# Altium schematic sheet LCD + TOUCH .SchDoc: MISKO 3.0
size A4; Date: 19.9.2021; Author: AMADEJ PAPEŽ; SheetNumber: 7; SheetTotal: 13; SheetTitle: LCD + TOUCH; Version: V1.1
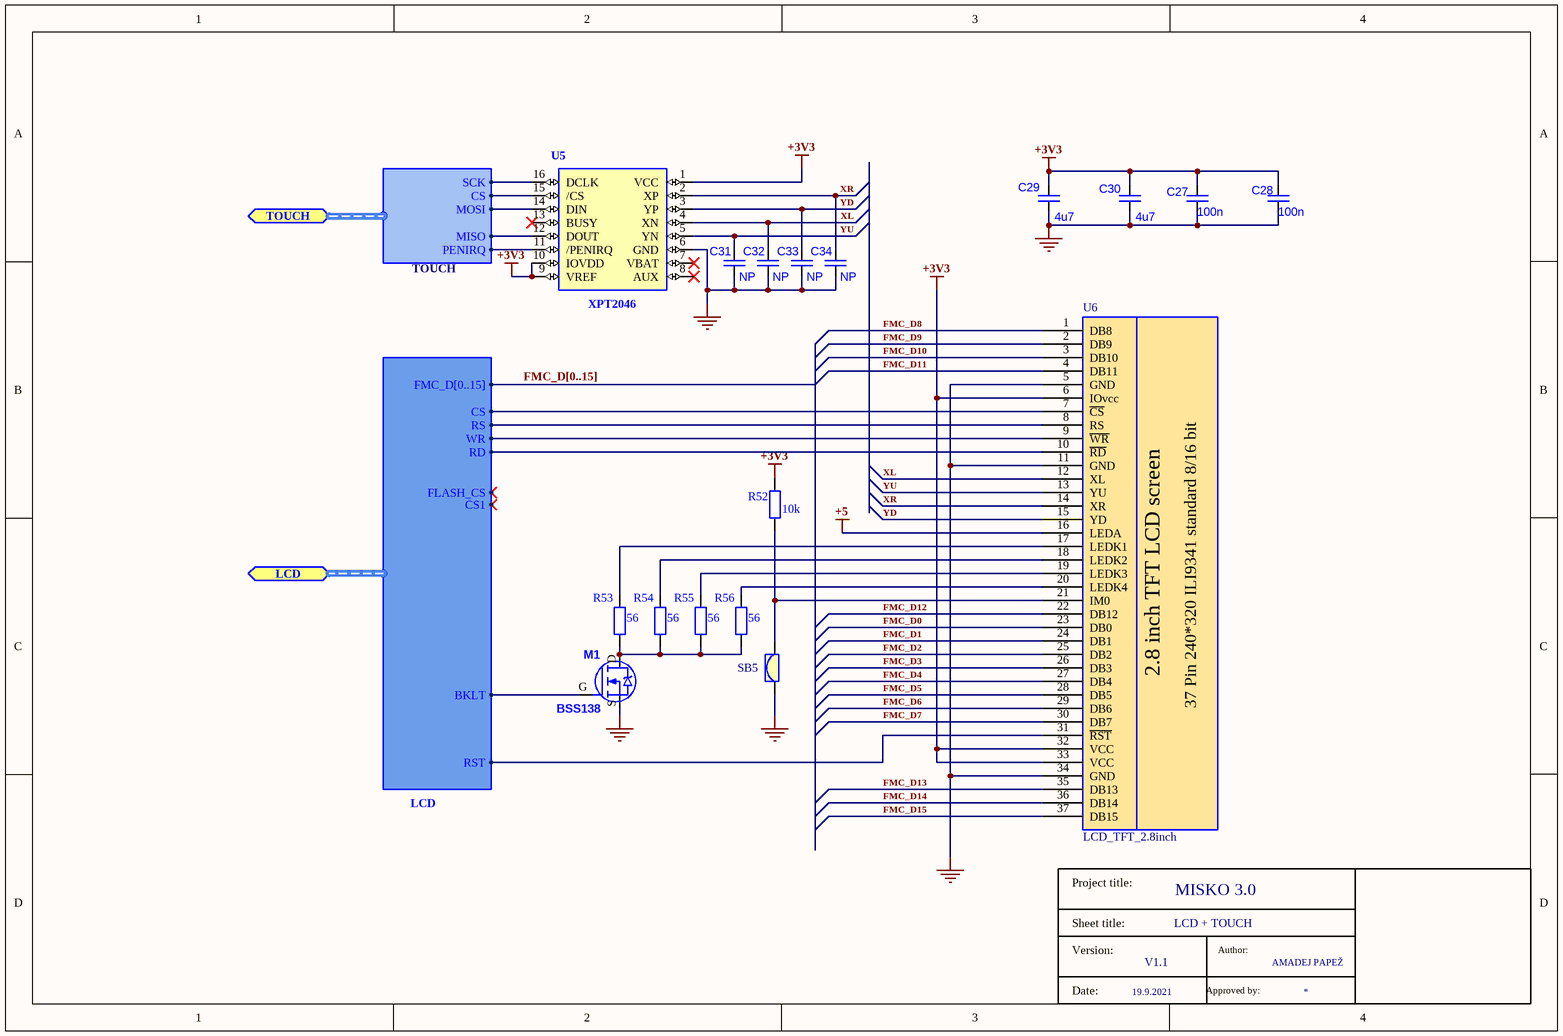
[diagram p0: LCD + TOUCH .SchDoc]

## Parts
C27  value 100n  [C0603]
C28  value 100n  [C0603]
C29  value 4u7  [C0603]
C30  value 4u7  [C0603]
C31  value NP  [C0603]
C32  value NP  [C0603]
C33  value NP  [C0603]
C34  value NP  [C0603]
M1  BSS138  [SOT23-3_L]
R52  value 10k  [R1608_0603I_L]
R53  value 56  [R1608_0603I_L]
R54  value 56  [R1608_0603I_L]
R55  value 56  [R1608_0603I_L]
R56  value 56  [R1608_0603I_L]
SB5  SD_JUMP  [SOLDER_JUMPER]  (value not drawn)
T7  (no value)
U5  XPT2046  [TSSOP16]
U6  LCD_TFT_2.8inch  [LCD_TFT_2.8inch]

## Ports
LCD (bidir, harness LCD), TOUCH (bidir, harness TOUCH)

## Harnesses
LCD: FMC_D[0..15], RST, BKLT, RD, WR, RS, CS, FLASH_CS, CS1
TOUCH: PENIRQ, CS, SCK, MISO, MOSI

## Nets
+3V3: C27.2 C28.2 C29.2 C30.2 R52.2 U5.1(VCC) U5.9(VREF) U5.10(IOVDD) U6.6(IOvcc) U6.32(VCC) U6.33(VCC)
+5: U6.16(LEDA)
GND: C27.1 C28.1 C29.1 C30.1 C31.1 C32.1 C33.1 C34.1 M1.S SB5.1 U5.6(GND) U6.5(GND) U6.11(GND) U6.34(GND)
FMC_D0: U6.23(DB0)
FMC_D1: U6.24(DB1)
FMC_D2: U6.25(DB2)
FMC_D3: U6.26(DB3)
FMC_D4: U6.27(DB4)
FMC_D5: U6.28(DB5)
FMC_D6: U6.29(DB6)
FMC_D7: U6.30(DB7)
FMC_D8: U6.1(DB8)
FMC_D9: U6.2(DB9)
FMC_D10: U6.3(DB10)
FMC_D11: U6.4(DB11)
FMC_D12: U6.22(DB12)
FMC_D13: U6.35(DB13)
FMC_D14: U6.36(DB14)
FMC_D15: U6.37(DB15)
XL: C32.2 U5.4(XN) U6.12(XL)
XR: C34.2 U5.2(XP) U6.14(XR)
YD: C33.2 U5.3(YP) U6.15(YD)
YU: C31.2 U5.5(YN) U6.13(YU)
NetM1_D: M1.D R53.1 R54.1 R55.1 R56.1
NetM1_G: M1.G ; port LCD.BKLT
NetR52_1: R52.1 SB5.2 U6.21(IM0)
NetR53_2: R53.2 U6.17(LEDK1)
NetR54_2: R54.2 U6.18(LEDK2)
NetR55_2: R55.2 U6.19(LEDK3)
NetR56_2: R56.2 U6.20(LEDK4)
NetU5_11: U5.11(/PENIRQ) ; port TOUCH.PENIRQ
NetU5_12: U5.12(DOUT) ; port TOUCH.MISO
NetU5_14: U5.14(DIN) ; port TOUCH.MOSI
NetU5_15: U5.15(/CS) ; port TOUCH.CS
NetU5_16: U5.16(DCLK) ; port TOUCH.SCK
NetU6_7: U6.7(~{CS}) ; port LCD.CS
NetU6_8: U6.8(RS) ; port LCD.RS
NetU6_9: U6.9(~{WR}) ; port LCD.WR
NetU6_10: U6.10(~{RD}) ; port LCD.RD
NetU6_31: U6.31(~{RST}) ; port LCD.RST

Not connected (* = marked no-connect by the designer): U5 7(VBAT)* 8(AUX)* 13(BUSY)*

## Buses and harness runs
bus FMC_D[0..15]

## Notes on the sheet
- (in symbol LCD_TFT_2.8inch) 2.8 inch TFT LCD screen; 37 Pin 240*320 ILI9341 standard 8/16 bit
- (in symbol Title block) Project title:; Sheet title:; Version:; Author:; Date:; Approved by:

## Library data of the parts
C27 C28 = C: Capacitor; Code: NB6-100N
C29 C30 = C: Capacitor; Code: NB7-4U7-25V
C31-C34 = C: Capacitor; Code: NB2-10P
M1 = BSH103: BSH103-T/R (NMOS); pin to pad: D>3 G>1 S>2; Code: BSH103-T/R
R52 = R: Code: LC5-10K
R53-R56 = R: Code: LC2-56E
T7 = Title block
U5 = XPT2046: LCD touch controller; MF: Xptek; Code: KLCD-XPT2046; Value: *; Package: Package; MP: XPT2046; Price: None; Check_prices: https://www.snapeda.com/parts/XPT2046/Xptek/view-part/5164510/?ref=eda; ComponentLink1Description: Supplier1; ComponentLink1URL: *; ComponentLink2Description: Supplier 1 code; ComponentLink2URL: *; Parameter 1: *